# EAGLE schematic 2018-SPIT-IH-Ver4-Atmeha-final1 (EAGLE 6.1)

## Sheet 1 of 3
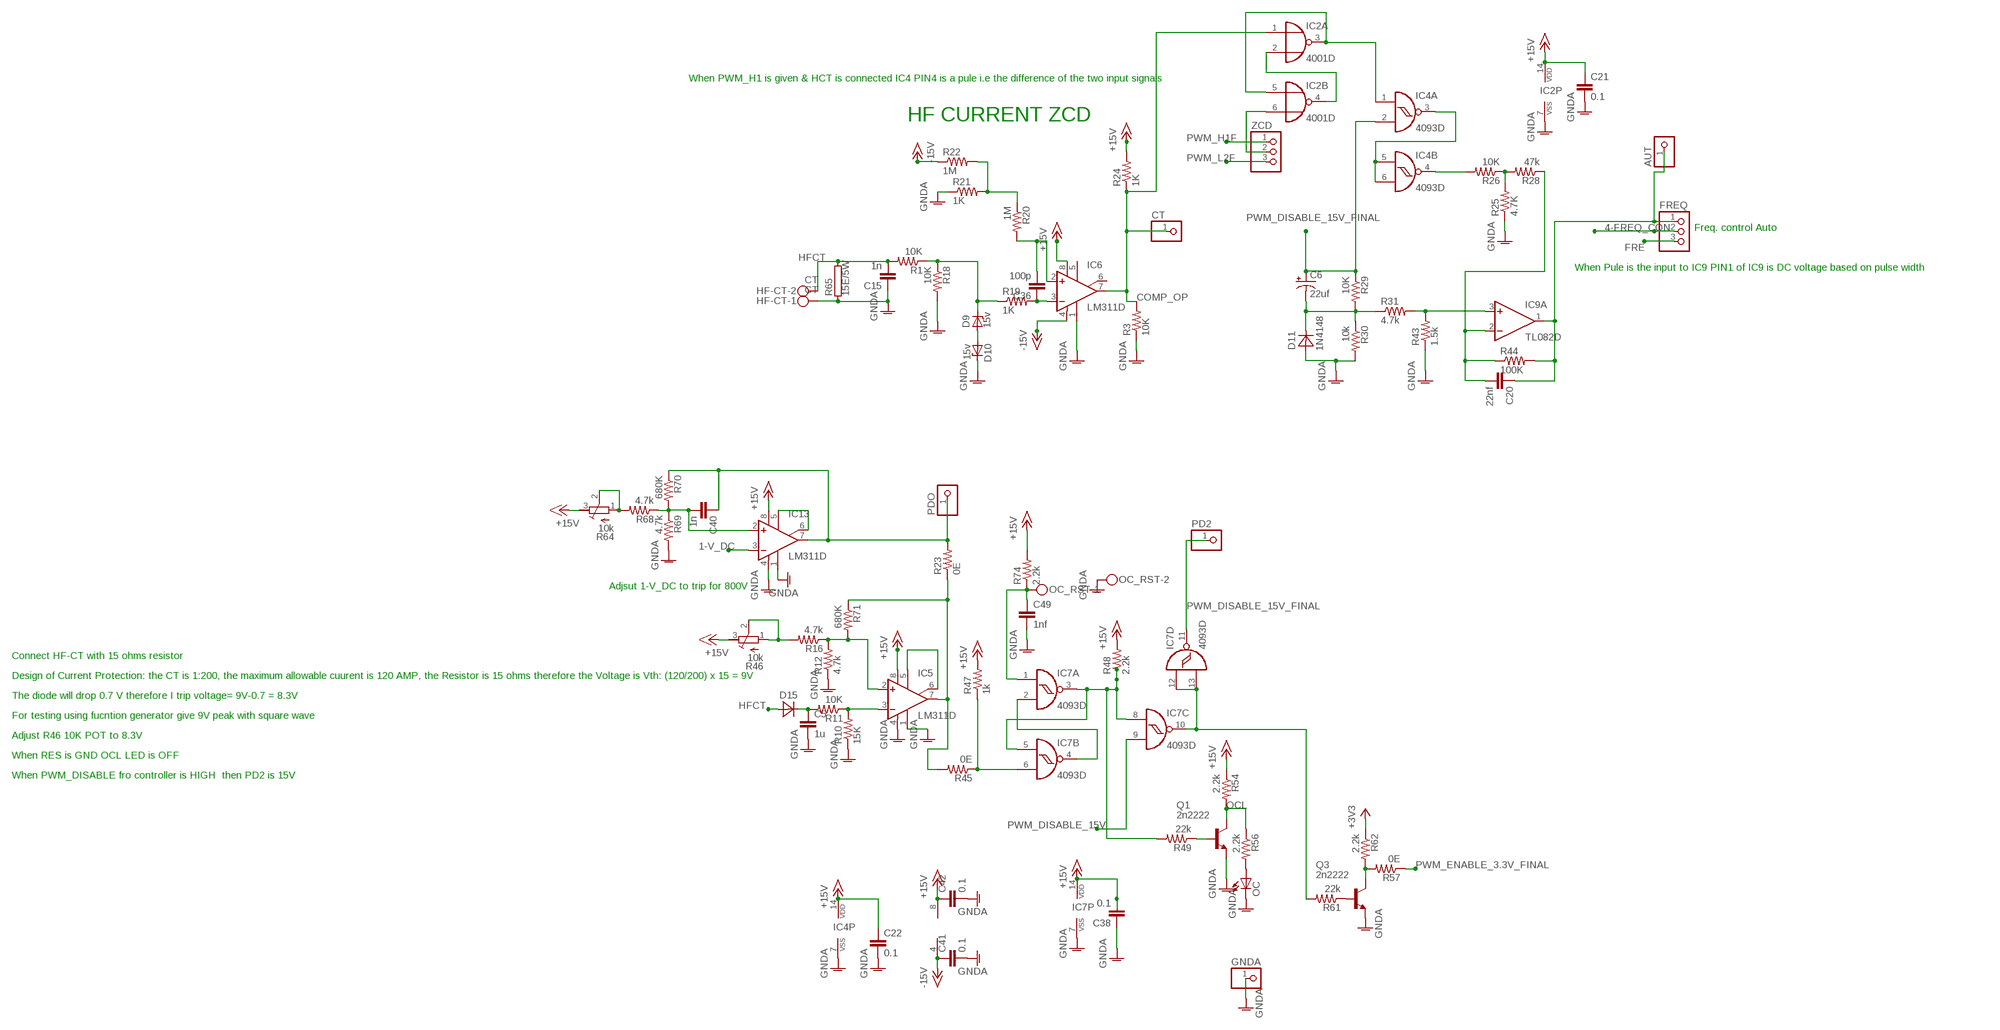
[diagram p0: schematic, sheet 1, part 1 of 2]
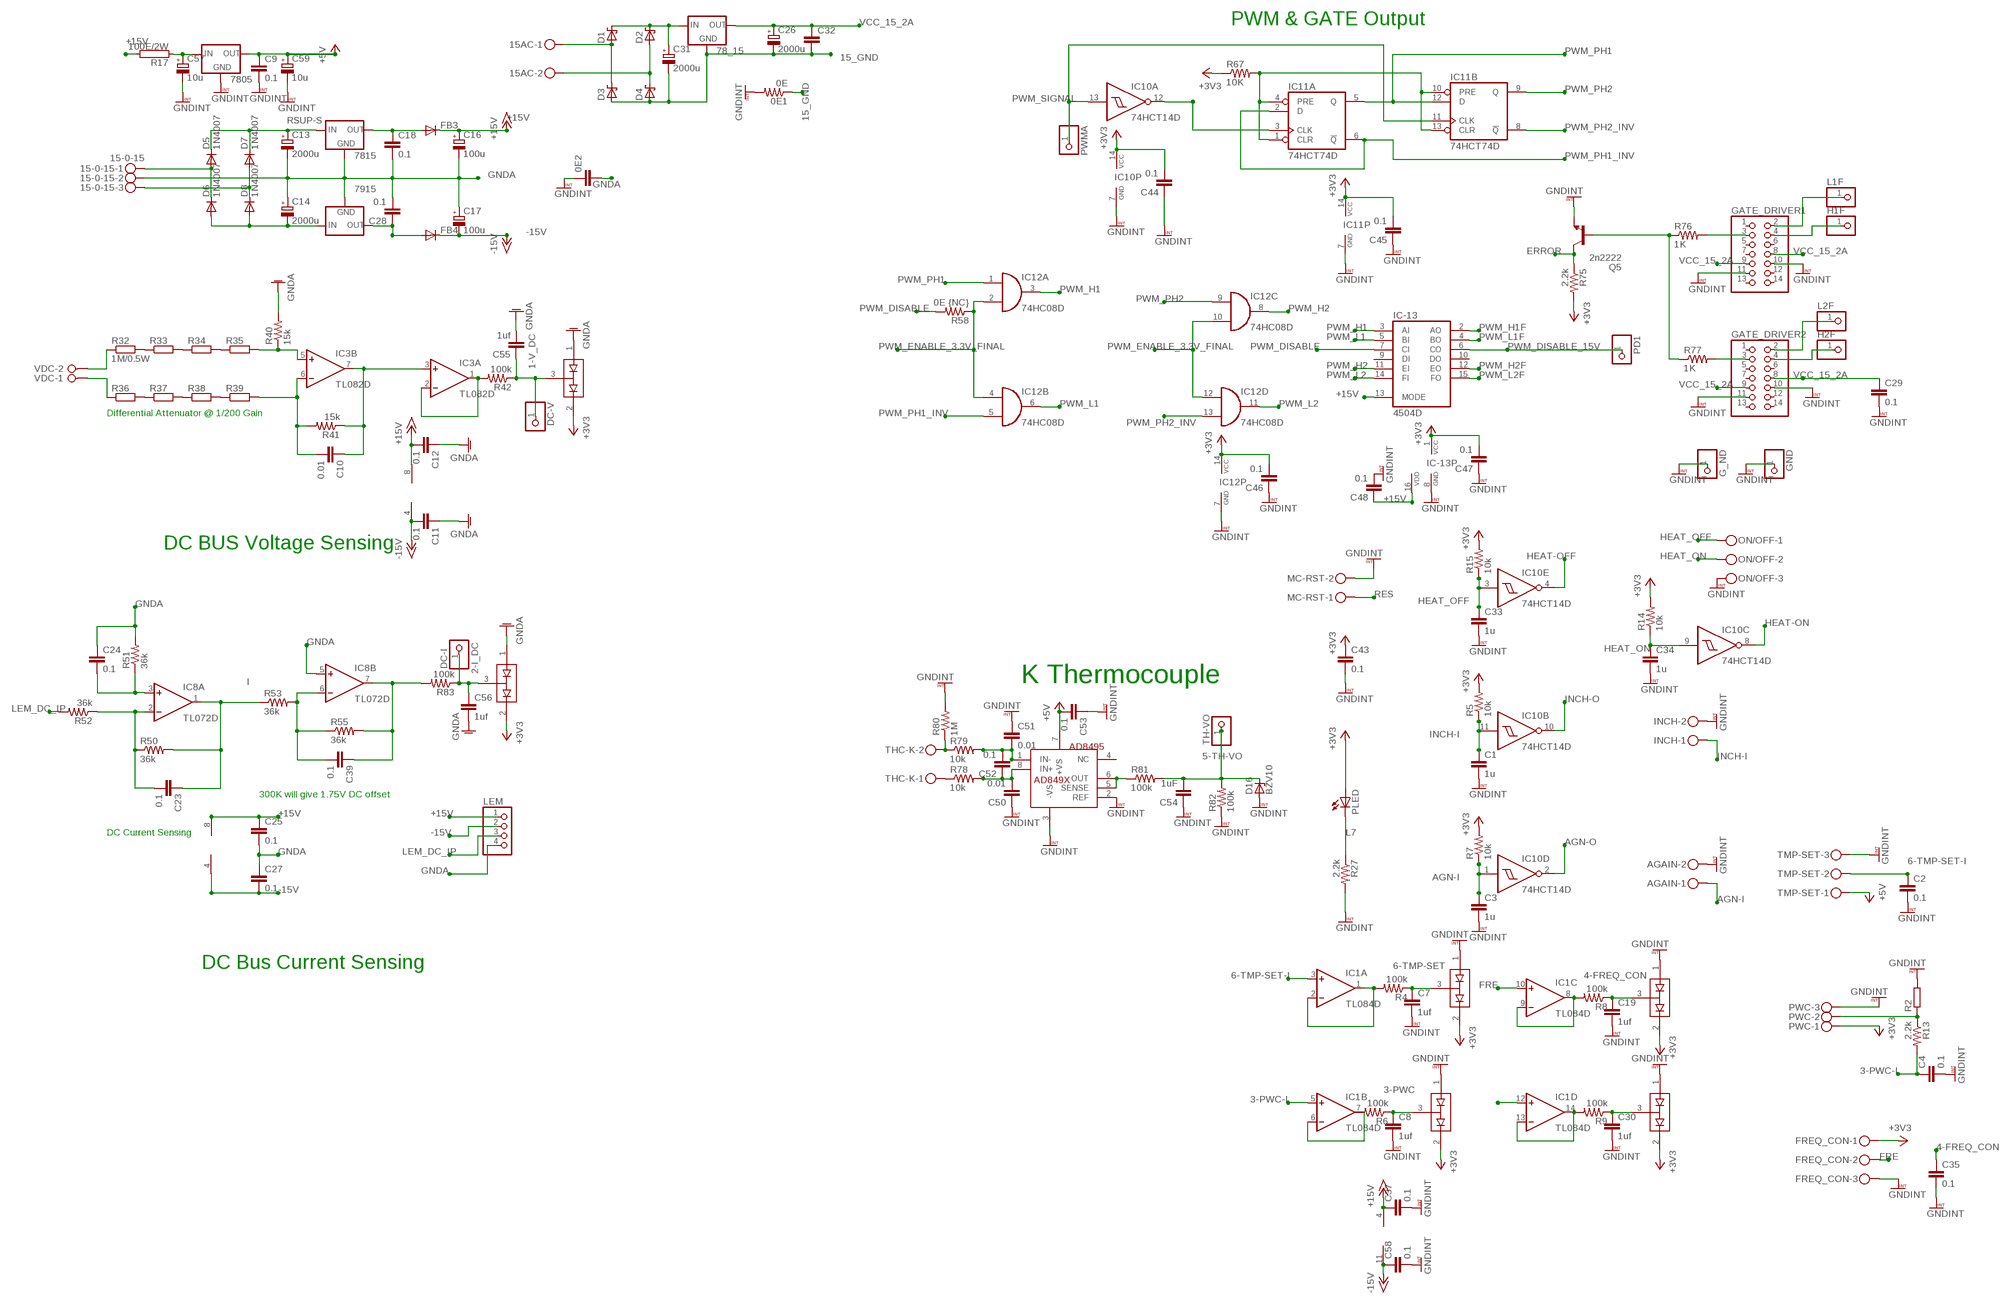
[diagram p1: schematic, sheet 1, part 2 of 2]

### Parts
0E1  0E  R-US_M1206  [M1206]
0E2  C-EUC1206  [C1206]
15-0-15  15-0-15  MKDSN1,5/3-5,08  [MKDSN1,5/3-5,08]
15AC  MKDSN1,5/2-5,08  [MKDSN1,5/2-5,08]
78_15  78XX-TO3  [TO3-78]
7805  78XXS  [78XXS]
7815  78XXS  [78XXS]
7915  79XXS  [79XXS]
AD8495  AD849X  [MSOP8]
AGAIN  MKDSN1,5/2-5,08  [MKDSN1,5/2-5,08]
AUT  PINHD-1X1  [1X01]
C1  1u  C-EUC1206  [C1206]
C2  0.1  C-EUC1206  [C1206]
C3  1u  C-EUC1206  [C1206]
C4  0.1  C-EUC1206  [C1206]
C5  1u  C-EUC1206  [C1206]
C6  22uf  CPOL-USE2.5-6  [E2,5-6]
C7  1uf  C-EUC1206  [C1206]
C8  1uf  C-EUC1206  [C1206]
C9  0.1  C-EUC1206  [C1206]
C10  0.01  C-EUC1206  [C1206]
C11  0.1  C-EUC1206  [C1206]
C12  0.1  C-EUC1206  [C1206]
C13  2000u  CPOL-EUE5-13  [E5-13]
C14  2000u  CPOL-EUE5-13  [E5-13]
C15  1n  C-EUC1206  [C1206]
C16  100u  CPOL-EUE5-8.5  [E5-8,5]
C17  100u  CPOL-EUE5-8.5  [E5-8,5]
C18  0.1  C-EUC1206  [C1206]
C19  1uf  C-EUC1206  [C1206]
C20  22nf  C-EUC1206  [C1206]
C21  0.1  C-EUC1206  [C1206]
C22  0.1  C-EUC1206  [C1206]
C23  0.1  C-EUC1206  [C1206]
C24  0.1  C-EUC1206  [C1206]
C25  0.1  C-EUC1206  [C1206]
C26  2000u  CPOL-EUE7.5-18  [E7,5-18]
C27  0.1  C-EUC1206  [C1206]
C28  0.1  C-EUC1206  [C1206]
C29  0.1  C-EUC1206  [C1206]
C30  1uf  C-EUC1206  [C1206]
C31  2000u  CPOL-EUE7.5-18  [E7,5-18]
C32  C-EU025-025X050  [C025-025X050]
C33  1u  C-EUC1206  [C1206]
C34  1u  C-EUC1206  [C1206]
C35  0.1  C-EUC1206  [C1206]
C36  100p  C-EUC1206  [C1206]
C37  0.1  C-EUC1206  [C1206]
C38  0.1  C-EUC1206  [C1206]
C39  0.1  C-EUC1206  [C1206]
C40  1n  C-EUC1206  [C1206]
C41  0.1  C-EUC1206  [C1206]
C42  0.1  C-EUC1206  [C1206]
C43  0.1  C-EUC1206  [C1206]
C44  0.1  C-EUC1206  [C1206]
C45  0.1  C-EUC1206  [C1206]
C46  0.1  C-EUC1206  [C1206]
C47  0.1  C-EUC1206  [C1206]
C48  0.1  C-EUC1206  [C1206]
C49  1nf  C-EUC1206  [C1206]
C50  0.01  C-EUC1206  [C1206]
C51  0.01  C-EUC1206  [C1206]
C52  0.1  C-EUC1206  [C1206]
C53  0.1  C-EUC1206  [C1206]
C54  1uF  C-EUC1206  [C1206]
C55  1uf  C-EUC1206  [C1206]
C56  1uf  C-EUC1206  [C1206]
C57  10u  CPOL-EUR/2012-12R  [R/2012-12R]
C58  0.1  C-EUC1206  [C1206]
C59  10u  CPOL-EUR/2012-12R  [R/2012-12R]
CT  PINHD-1X1  [1X01]
D1  1N5908  [C4111-15]
D2  1N5908  [C4111-15]
D3  1N5908  [C4111-15]
D4  1N5908  [C4111-15]
D5  1N4007  1N4004  [DO41-10]
D6  1N4007  1N4004  [DO41-10]
D7  1N4007  1N4004  [DO41-10]
D8  1N4007  1N4004  [DO41-10]
D9  15v  ZENER-DIODEDO34-7  [DO34Z7]
D10  15v  ZENER-DIODEDO34-7  [DO34Z7]
D11  1N4148  MBRA340T3  [SMA]
D12  BAV99  [SOT23]
D14  BAV99  [SOT23]
D15  MBRA340T3  [SMA]
D16  BZV10  [DO34Z7]
D17  BAV99  [SOT23]
D18  BAV99  [SOT23]
D19  BAV99  [SOT23]
D20  BAV99  [SOT23]
DC-I  PINHD-1X1  [1X01]
DC-V  PINHD-1X1  [1X01]
FB3  1N5061  [SOD57-10]
FB4  1N5061  [SOD57-10]
FREQ  PINHD-1X3  [1X03]
FREQ_CON  MKDSN1,5/3-5,08  [MKDSN1,5/3-5,08]
G_ND  PINHD-1X1  [1X01]
GATE_DRIVER1  PINHD-2X7  [2X07]
GATE_DRIVER2  PINHD-2X7  [2X07]
GND  PINHD-1X1  [1X01]
GNDA  PINHD-1X1  [1X01]
H1F  PINHD-1X1  [1X01]
H2F  PINHD-1X1  [1X01]
HF-CT  CT  MKDSN1,5/2-5,08  [MKDSN1,5/2-5,08]
IC1  TL084D  [SO14]
IC2  4001D  [SO14]
IC3  TL082D  [SO08]
IC4  4093D  [SO14]
IC5  LM311D  [SO08]
IC6  LM311D  [SO08]
IC7  4093D  [SO14]
IC8  TL072D  [SO08]
IC9  TL082D  [SO08]
IC10  74HCT14D  [SO14]
IC11  74HCT74D  [SO14]
IC12  74HC08D  [SO14]
IC13  LM311D  [SO08]
IC-13  4504D  [SO16]
INCH  MKDSN1,5/2-5,08  [MKDSN1,5/2-5,08]
L1F  PINHD-1X1  [1X01]
L2F  PINHD-1X1  [1X01]
LEM  PINHD-1X4  [1X04]
MC-RST  MKDSN1,5/2-5,08  [MKDSN1,5/2-5,08]
OC  LEDCHIPLED_1206  [CHIPLED_1206]
OC_RST  MKDSN1,5/2-5,08  [MKDSN1,5/2-5,08]
ON/OFF  MKDSN1,5/3-5,08  [MKDSN1,5/3-5,08]
PD1  PINHD-1X1  [1X01]
PD2  PINHD-1X1  [1X01]
PDO  PINHD-1X1  [1X01]
PLED  LEDCHIPLED_1206  [CHIPLED_1206]
PWC  MKDSN1,5/3-5,08  [MKDSN1,5/3-5,08]
PWMA  PINHD-1X1  [1X01]
Q1  2n2222  BCW33SMD  [SOT23-BEC]
Q3  2n2222  BCW33SMD  [SOT23-BEC]
Q5  2n2222  BCW33SMD  [SOT23-BEC]
R1  10K  R-US_M1206  [M1206]
R2  R-EU_0309/12  [0309/12]
R3  10K  R-US_M1206  [M1206]
R4  100k  R-US_M1206  [M1206]
R5  10k  R-US_M1206  [M1206]
R6  100k  R-US_M1206  [M1206]
R7  10k  R-US_M1206  [M1206]
R8  100k  R-US_M1206  [M1206]
R9  100k  R-US_M1206  [M1206]
R10  15K  R-US_M1206  [M1206]
R11  10K  R-US_M1206  [M1206]
R12  4.7k  R-US_M1206  [M1206]
R13  2.2k  R-US_M1206  [M1206]
R14  10k  R-US_M1206  [M1206]
R15  10k  R-US_M1206  [M1206]
R16  4.7k  R-US_M1206  [M1206]
R17  100E/2W  RCA5050  [CA5050]
R18  10K  R-US_M1206  [M1206]
R19  1K  R-US_M1206  [M1206]
R20  1M  R-US_M1206  [M1206]
R21  1K  R-US_M1206  [M1206]
R22  1M  R-US_M1206  [M1206]
R23  0E  R-US_M1206  [M1206]
R24  1K  R-US_M1206  [M1206]
R25  4.7K  R-US_M1206  [M1206]
R26  10K  R-US_M1206  [M1206]
R27  2.2k  R-US_M1206  [M1206]
R28  47k  R-US_M1206  [M1206]
R29  10K  R-US_M1206  [M1206]
R30  10k  R-US_M1206  [M1206]
R31  4.7k  R-US_M1206  [M1206]
R32  1M/0.5W  R-EU_0309/12  [0309/12]
R33  R-EU_0309/12  [0309/12]
R34  R-EU_0309/12  [0309/12]
R35  R-EU_0309/12  [0309/12]
R36  R-EU_0309/12  [0309/12]
R37  R-EU_0309/12  [0309/12]
R38  R-EU_0309/12  [0309/12]
R39  R-EU_0309/12  [0309/12]
R40  15k  R-US_M1206  [M1206]
R41  15k  R-US_M1206  [M1206]
R42  100k  R-US_M1206  [M1206]
R43  1.5k  R-US_M1206  [M1206]
R44  100K  R-US_M1206  [M1206]
R45  0E  R-US_M1206  [M1206]
R46  10k  R-TRIMM64W  [RTRIM64W]
R47  1k  R-US_M1206  [M1206]
R48  2.2k  R-US_M1206  [M1206]
R49  22k  R-US_M1206  [M1206]
R50  36k  R-US_M1206  [M1206]
R51  36k  R-US_M1206  [M1206]
R52  36k  R-US_M1206  [M1206]
R53  36k  R-US_M1206  [M1206]
R54  2.2k  R-US_M1206  [M1206]
R55  36k  R-US_M1206  [M1206]
R56  2.2k  R-US_M1206  [M1206]
R57  0E  R-US_M1206  [M1206]
R58  0E {NC}  R-US_M1206  [M1206]
R61  22k  R-US_M1206  [M1206]
R62  2.2k  R-US_M1206  [M1206]
R64  10k  R-TRIMM64W  [RTRIM64W]
R65  15E/5W  RMPC71-5  [MPC71-5]
R67  10K  R-US_M1206  [M1206]
R68  4.7k  R-US_M1206  [M1206]
R69  4.7k  R-US_M1206  [M1206]
R70  680K  R-US_M1206  [M1206]
R71  680K  R-US_M1206  [M1206]
R74  2.2k  R-US_M1206  [M1206]
R75  2.2k  R-US_M1206  [M1206]
R76  1K  R-US_M1206  [M1206]
R77  1K  R-US_M1206  [M1206]
R78  10k  R-US_M1206  [M1206]
R79  10k  R-US_M1206  [M1206]
R80  1M  R-US_M1206  [M1206]
R81  100k  R-US_M1206  [M1206]
R82  100k  R-US_M1206  [M1206]
R83  100k  R-US_M1206  [M1206]
TH-VO  PINHD-1X1  [1X01]
THC-K  MKDSN1,5/2-5,08  [MKDSN1,5/2-5,08]
TMP-SET  MKDSN1,5/3-5,08  [MKDSN1,5/3-5,08]
VDC  W237-2N  [W237-2N]
ZCD  PINHD-1X3  [1X03]

### Nets
1-V_DC: C55.1 D12.3(COM) DC-V.1 IC13.3(-IN) R42.1 ; also sheet 2
2: C39.1 IC8.7(B:OUT) R55.2 R83.2
2-I_DC: C56.1 D14.3(COM) DC-I.1 R83.1 ; also sheet 2
3-PWC: C8.1 D18.3(COM) R6.1 ; also sheet 2
3-PWC-I: C4.1 IC1.5(B:+IN) R13.2
4-FREQ_CON: C19.1 C35.1 D20.3(COM) FREQ.2 R8.1 ; also sheet 2
5-TH-VO: C54.2 D16.C R81.2 R82.2 TH-VO.1 ; also sheet 2
6-TMP-SET: C7.1 D17.3(COM) R4.1 ; also sheet 2
6-TMP-SET-I: C2.1 IC1.3(A:+IN) TMP-SET.2
15_GND: 0E1.1 78_15.3(GND) C26.- C31.- C32.2 D3.A D4.A
+5V: 7805.OUT AD8495.7(+VS) C9.1 C43.1 C44.2 C45.2 C46.2 C47.2 C53.2 C59.+ D12.2(C2) D14.2(C2) D17.2(C2) D18.2(C2) D19.2(C2) D20.2(C2) FREQ_CON.1 IC10.14(P:VCC) IC11.14(P:VCC) IC12.14(P:VCC) IC-13.1(VCC) PLED.A PWC.1 R5.2 R7.2 R14.2 R15.2 R62.1 R67.1 R75.2 TMP-SET.1 ; supply symbol labelled +3V3 ; also sheet 2
+15V: C12.2 C16.+ C21.1 C22.1 C25.1 C37.1 C38.2 C42.1 C48.1 FB3.C IC1.4(P:V+) IC2.14(P:VDD) IC3.8(P:V+) IC4.14(P:VDD) IC5.8(V+) IC6.8(V+) IC7.14(P:VDD) IC8.8(P:V+) IC9.8(P:V+) IC13.8(V+) IC-13.13(MODE) IC-13.16(VDD) LEM.1 R17.2 R24.2 R46.3(A) R47.2 R48.2 R54.1 R64.3(A) R74.2
-15V: C11.2 C17.- C27.2 C41.1 C58.1 FB4.C IC1.11(P:V-) IC3.4(P:V-) IC6.4(V-) IC8.4(P:V-) IC9.4(P:V-) LEM.2 R22.1
AGN-I: AGAIN.1 C3.1 IC10.1(D:I) R7.1
AGN-O: IC10.2(D:O) ; also sheet 2
COMP_OP: CT.1 IC2.1(A:I0) IC6.7(OUT) R3.2 R24.1
ERROR: Q5.C R75.1 ; also sheet 2
FRE: FREQ.3 FREQ_CON.2 IC1.10(C:+IN)
GNDA: 0E2.2 15-0-15.2 7815.GND 7915.GND C5.2 C11.1 C12.1 C13.- C14.+ C15.1 C16.- C17.+ C18.2 C21.2 C22.2 C24.1 C25.2 C27.1 C28.2 C38.1 C41.2 C42.2 C49.2 C55.2 C56.2 D10.C D11.A D12.1(A1) D14.1(A1) GNDA.1 HF-CT.1 IC2.7(P:VSS) IC4.7(P:VSS) IC5.1(GND) IC5.4(V-) IC6.1(GND) IC7.7(P:VSS) IC8.5(B:+IN) IC13.1(GND) IC13.4(V-) LEM.4 OC.C OC_RST.2 Q1.E Q3.E R3.1 R10.1 R12.1 R18.2 R21.1 R25.1 R30.2 R40.2 R43.1 R51.2 R65.1 R69.2
GNDINT: 0E1.2 0E2.1 7805.GND AD8495.2(REF) AD8495.3(-VS) AGAIN.2 C1.2 C2.2 C3.2 C4.2 C7.2 C8.2 C9.2 C19.2 C29.2 C30.2 C33.2 C34.2 C35.2 C37.2 C43.2 C44.1 C45.1 C46.1 C47.1 C48.2 C50.1 C51.1 C53.1 C54.1 C57.- C58.2 C59.- D16.A D17.1(A1) D18.1(A1) D19.1(A1) D20.1(A1) FREQ_CON.3 G_ND.1 GATE_DRIVER1.10 GATE_DRIVER1.11 GATE_DRIVER2.10 GATE_DRIVER2.11 GND.1 IC10.7(P:GND) IC11.7(P:GND) IC12.7(P:GND) IC-13.8(GND) INCH.2 MC-RST.2 ON/OFF.3 PWC.3 Q5.E R2.2 R27.2 R80.2 R82.1 TMP-SET.3 ; also sheet 2
HEAT-OFF: IC10.4(E:O) ; also sheet 2
HEAT-ON: IC10.8(C:O) ; also sheet 2
HEAT_OFF: C33.1 IC10.3(E:I) ON/OFF.1 R15.1
HEAT_ON: C34.1 IC10.9(C:I) ON/OFF.2 R14.1
HFCT: C15.2 D15.A HF-CT.2 R1.2 R65.2
I: C23.1 IC8.1(A:OUT) R50.2 R53.1
INCH-I: C1.1 IC10.11(B:I) INCH.1 R5.1
INCH-O: IC10.10(B:O) ; also sheet 2
L7: PLED.C R27.1
LEM_DC_IP: LEM.3 R52.2
N$1: IC1.1(A:OUT) IC1.2(A:-IN) R4.2
N$2: IC4.3(A:O) IC4.5(B:I0) IC4.6(B:I1)
N$3: IC1.6(B:-IN) IC1.7(B:OUT)
N$4: IC1.8(C:OUT) IC1.9(C:-IN) R8.2
N$5: C49.1 IC7.1(A:I0) OC_RST.1 R74.1
N$6: IC1.13(D:-IN) IC1.14(D:OUT) R9.2
N$7: IC2.2(A:I1) IC2.4(B:O)
N$8: IC4.4(B:O) R26.2
N$9: AUT.1 C20.1 FREQ.1 IC9.1(A:OUT) R44.2
N$10: 15-0-15.1 D5.A D6.C
N$12: AD8495.8(IN+) C50.2 C52.1 R78.2
N$13: IC5.2(+IN) R12.2 R16.1 R71.2
N$14: IC2.3(A:O) IC2.5(B:I0) IC4.1(A:I0)
N$15: IC10.12(A:O) IC11.3(A:CLK)
N$16: IC5.5(ON) IC5.6(ON/STR)
N$17: IC5.3(-IN) R10.2 R11.1
N$18: PWC.2 R2.1 R13.1
N$19: IC11.1(A:CLR) IC11.4(A:PRE) IC11.10(B:PRE) IC11.13(B:CLR) R67.2
N$20: GATE_DRIVER1.3 R76.2
N$21: IC5.7(OUT) R23.1 R45.2 R71.1
N$22: IC7.6(B:I1) R45.1 R47.1
N$23: C5.1 D15.C R11.2
N$24: R32.2 R33.1
N$25: R33.2 R34.1
N$26: R34.2 R35.1
N$27: R36.2 R37.1
N$28: 15-0-15.3 D7.A D8.C
N$29: 7915.IN C14.- D6.A D8.A
N$30: D9.C R1.1 R18.1 R19.1
N$31: 7805.IN C57.+ R17.1
N$32: 7815.OUT C18.1 FB3.A
N$33: R37.2 R38.1
N$34: 7915.OUT C28.1 FB4.A
N$35: D9.A D10.A
N$36: R38.2 R39.1
N$37: C36.1 IC6.3(-IN) R19.2
N$38: C36.2 IC6.2(+IN) R20.2
N$39: R20.1 R21.2 R22.2
N$40: R16.2 R46.1(E) R46.2(S)
N$41: R32.1 VDC.2
N$42: Q1.B R49.1
N$43: R36.1 VDC.1
N$44: IC3.5(B:+IN) R35.2 R40.1
N$45: IC7.3(A:O) IC7.5(B:I0) IC7.8(C:I0) R48.1 R49.2
N$46: IC7.2(A:I1) IC7.4(B:O)
N$47: C10.2 IC3.6(B:-IN) R39.2 R41.2
N$48: C10.1 IC3.3(A:+IN) IC3.7(B:OUT) R41.1
N$49: R25.2 R26.1 R28.2
N$50: IC3.1(A:OUT) IC3.2(A:-IN) R42.2
N$51: AD8495.1(IN-) C51.2 C52.2 R79.2
N$52: IC7.10(C:O) IC7.12(D:I0) IC7.13(D:I1) R61.2
N$53: C6.- D11.C R29.2 R30.1 R31.1
N$54: IC1.12(D:+IN)
N$55: OC.A R56.2
N$56: IC2.6(B:I1) ZCD.2
N$57: IC9.3(A:+IN) R31.2 R43.2
N$58: GATE_DRIVER2.3 R77.2
N$59: C20.2 IC9.2(A:-IN) R28.1 R44.1
N$60: Q3.B R61.1
N$61: C23.2 IC8.2(A:-IN) R50.1 R52.1
N$62: C24.2 IC8.3(A:+IN) R51.1
N$63: R78.1 THC-K.1
N$64: C39.2 IC8.6(B:-IN) R53.2 R55.1
N$65: Q3.C R57.2 R62.2
N$69: IC13.5(ON) IC13.6(ON/STR)
N$71: Q5.B R76.1 R77.1
N$72: R79.1 R80.1 THC-K.2
N$73: R64.1(E) R64.2(S) R68.2
N$74: C40.2 IC13.2(+IN) R68.1 R69.1 R70.2
N$75: C40.1 IC13.7(OUT) PDO.1 R23.2 R70.1
N$76: AD8495.5(SENSE) AD8495.6(OUT) R81.1
N$80: C30.1 D19.3(COM) R9.1
N$85: 15AC.1 D1.A D3.C
N$86: 15AC.2 D2.A D4.C
N$87: 78_15.2(IN) C31.+ D1.C D2.C
OCL: Q1.C R54.2 R56.1
PWM_DISABLE: IC-13.7(CI) R58.2 ; also sheet 2
PWM_DISABLE_15V: IC7.9(C:I1) IC-13.6(CO) PD1.1
PWM_DISABLE_15V_FINAL: C6.+ IC4.2(A:I1) IC7.11(D:O) PD2.1 R29.1
PWM_ENABLE_3.3V_FINAL: IC12.2(A:I1) IC12.4(B:I0) IC12.10(C:I1) IC12.12(D:I0) R57.1 R58.1 ; also sheet 2
PWM_H1: IC12.3(A:O) IC-13.3(AI)
PWM_H1F: GATE_DRIVER1.4 H1F.1 IC-13.2(AO) ZCD.1
PWM_H2: IC12.8(C:O) IC-13.11(EI)
PWM_H2F: GATE_DRIVER2.4 H2F.1 IC-13.12(EO)
PWM_L1: IC12.6(B:O) IC-13.5(BI)
PWM_L1F: GATE_DRIVER1.2 IC-13.4(BO) L1F.1
PWM_L2: IC12.11(D:O) IC-13.14(FI)
PWM_L2F: GATE_DRIVER2.2 IC-13.15(FO) L2F.1 ZCD.3
PWM_PH1: IC11.5(A:Q) IC11.12(B:D) IC12.1(A:I0)
PWM_PH1_INV: IC11.2(A:D) IC11.6(A:!Q) IC12.5(B:I1)
PWM_PH2: IC11.9(B:Q) IC12.9(C:I0)
PWM_PH2_INV: IC11.8(B:!Q) IC12.13(D:I1)
PWM_SIGNAL: IC10.13(A:I) IC11.11(B:CLK) PWMA.1 ; also sheet 2
RES: MC-RST.1 ; also sheet 2
RSUP-S: 7815.IN C13.+ D5.C D7.C
VCC_15_2A: 78_15.1(OUT) C26.+ C29.1 C32.1 GATE_DRIVER1.8 GATE_DRIVER1.9 GATE_DRIVER2.8 GATE_DRIVER2.9
Unconnected: AD8495.4(NC) GATE_DRIVER1.1 GATE_DRIVER1.5 GATE_DRIVER1.6 GATE_DRIVER1.7 GATE_DRIVER1.12 GATE_DRIVER1.13 GATE_DRIVER1.14 GATE_DRIVER2.1 GATE_DRIVER2.5 GATE_DRIVER2.6 GATE_DRIVER2.7 GATE_DRIVER2.12 GATE_DRIVER2.13 GATE_DRIVER2.14 IC2.8(C:I0) IC2.9(C:I1) IC2.10(C:O) IC2.11(D:O) IC2.12(D:I0) IC2.13(D:I1) IC4.8(C:I0) IC4.9(C:I1) IC4.10(C:O) IC4.11(D:O) IC4.12(D:I0) IC4.13(D:I1) IC6.5(ON) IC6.6(ON/STR) IC9.5(B:+IN) IC9.6(B:-IN) IC9.7(B:OUT) IC10.5(F:I) IC10.6(F:O) IC-13.9(DI) IC-13.10(DO) R6.2

### Notes on the sheet
- PWM & GATE Output
- Differential Attenuator @ 1/200 Gain
- DC BUS Voltage Sensing
- K Thermocouple
- 300K will give 1.75V DC offset
- DC Current Sensing
- DC Bus Current Sensing
- When PWM_H1 is given & HCT is connected IC4 PIN4 is a pule i.e the difference of the two input signals
- HF CURRENT ZCD
- Freq. control Auto
- When Pule is the input to IC9 PIN1 of IC9 is DC voltage based on pulse width
- Adjsut 1-V_DC to trip for 800V
- Connect HF-CT with 15 ohms resistor
- Design of Current Protection: the CT is 1:200, the maximum allowable cuurent is 120 AMP, the Resistor is 15 ohms therefore the Voltage is Vth: (120/200) x 15 = 9V
- The diode will drop 0.7 V therefore I trip voltage= 9V-0.7 = 8.3V
- For testing using fucntion generator give 9V peak with square wave
- Adjust R46 10K POT to 8.3V
- When RES is GND OCL LED is OFF
- When PWM_DISABLE fro controller is HIGH  then PD2 is 15V

## Sheet 2 of 3
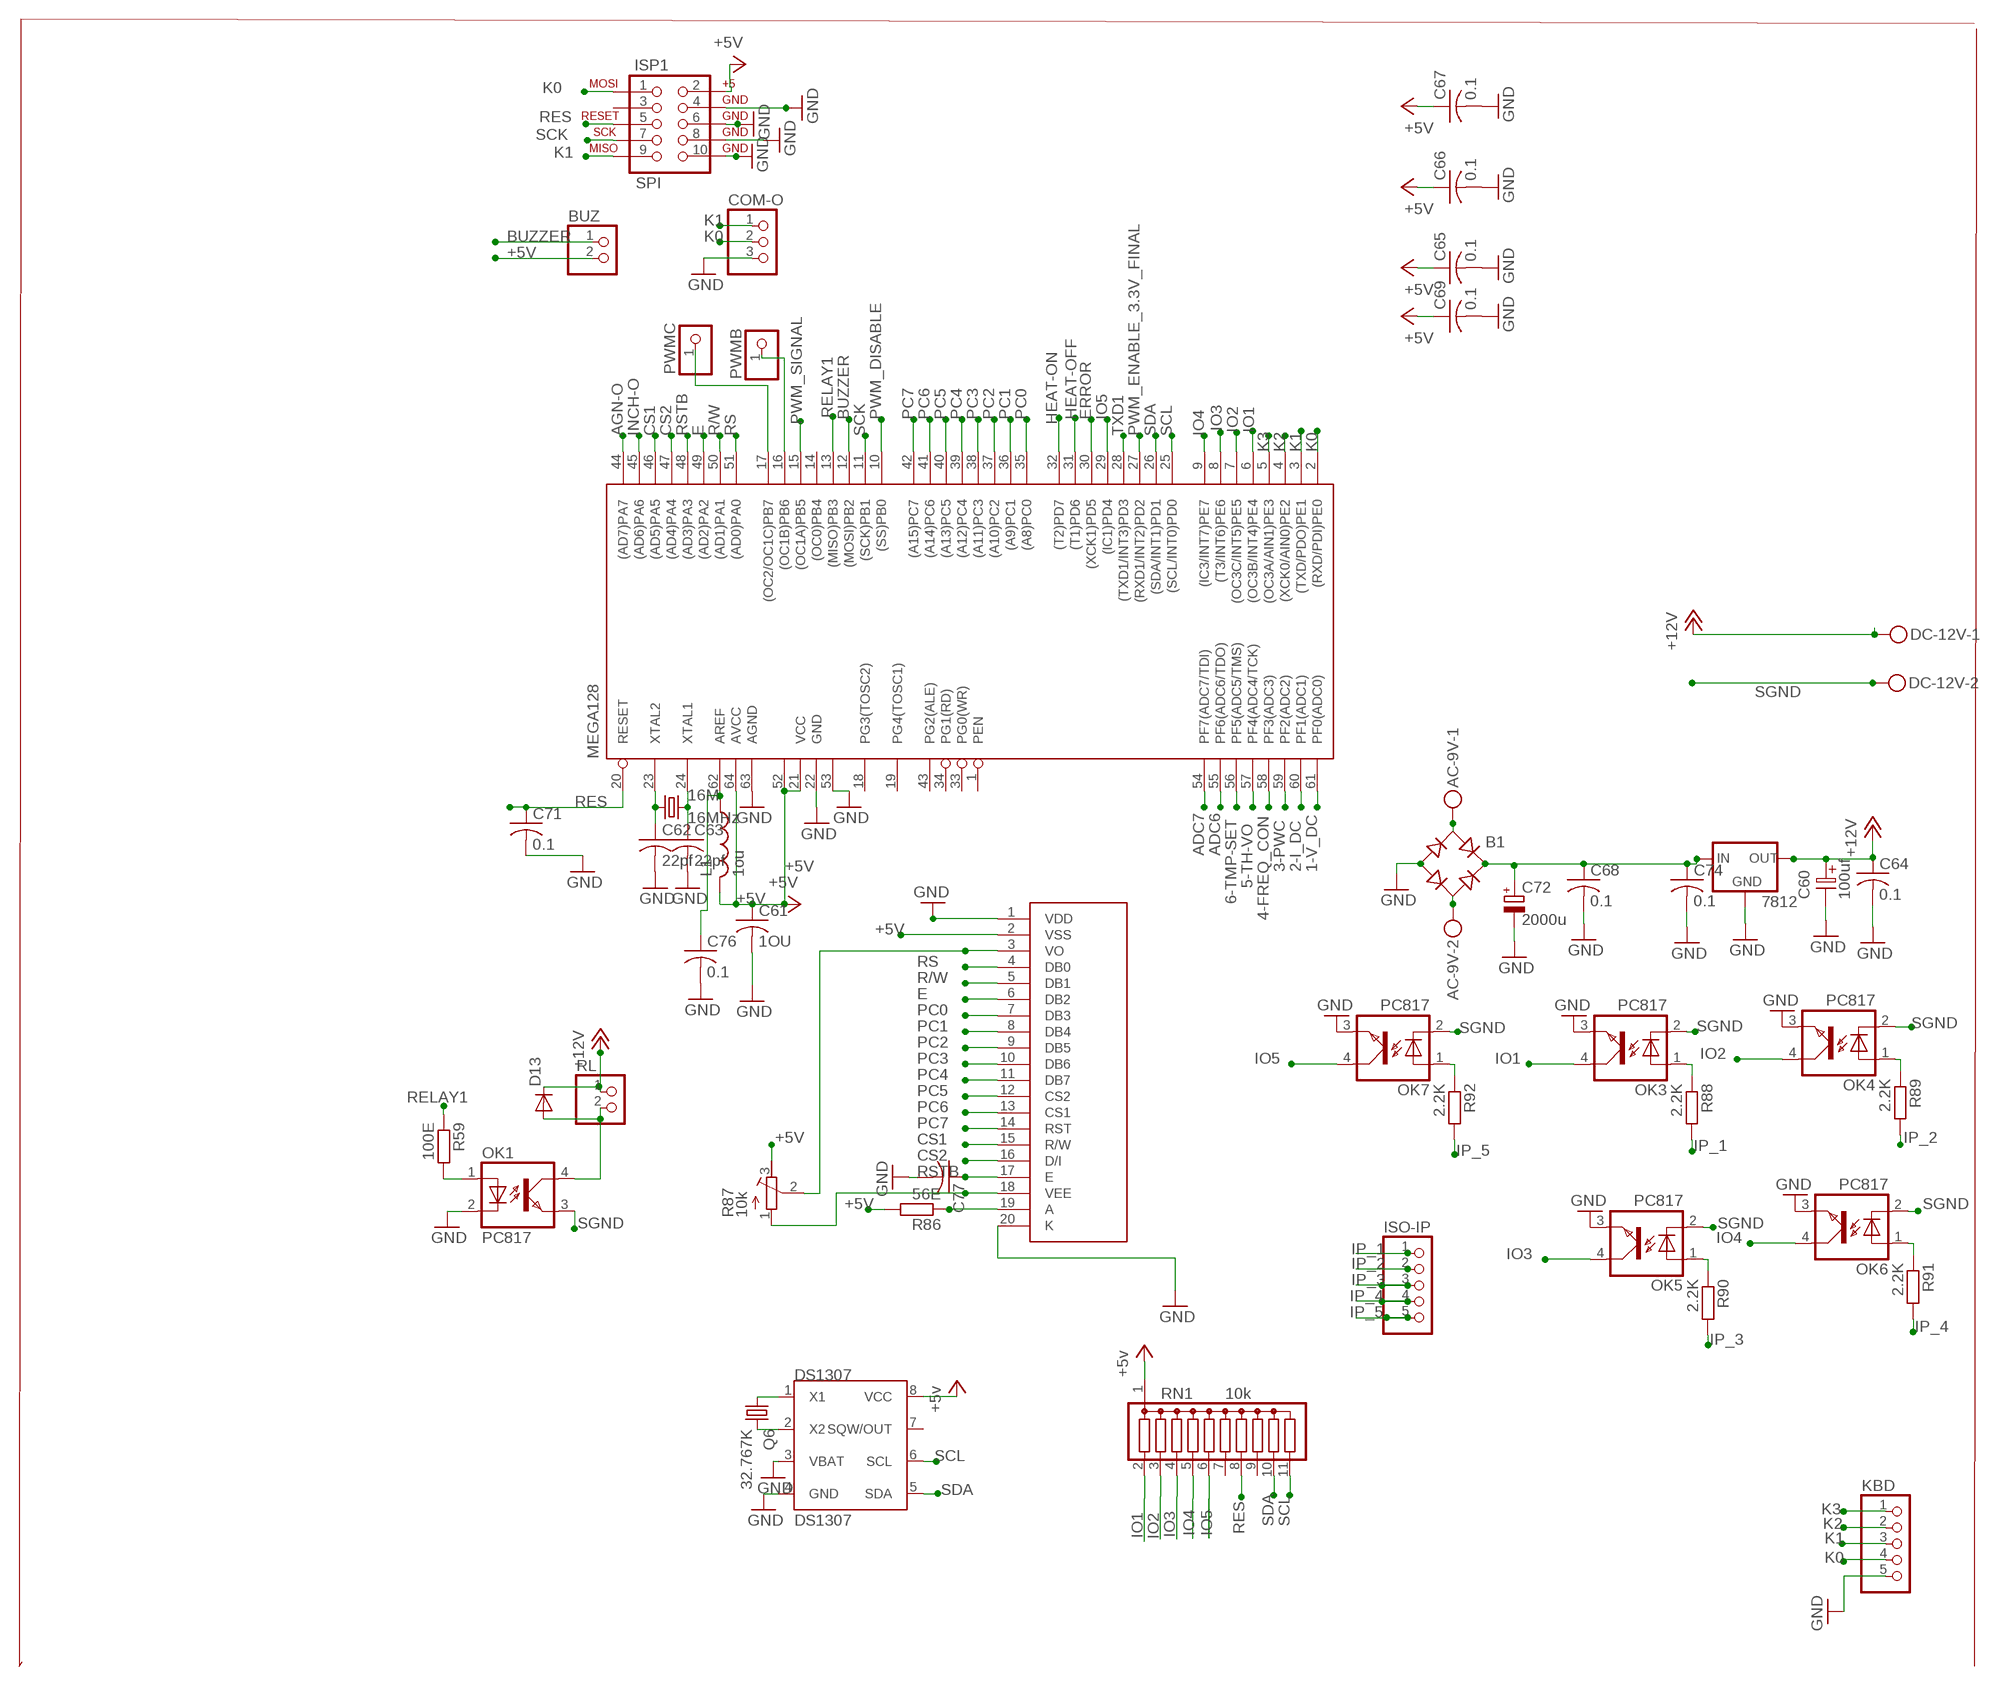
[diagram p2: schematic, sheet 2]

### Parts
16M  16MHz  CRYTALHC49S  [HC49/S]
7812  78XXS  [78XXS]
AC-9V  MKDSN1,5/2-5,08  [MKDSN1,5/2-5,08]
B1  RB1A  [RB1A]
BUZ  PINHD-1X2  [1X02]
C60  100uf  ELC-2,5  [ES-2,5]
C61  1OU  C-USC1206  [C1206]
C62  22pf  C-USC1206  [C1206]
C63  22pf  C-USC1206  [C1206]
C64  0.1  C-USC1206  [C1206]
C65  0.1  C-USC1206  [C1206]
C66  0.1  C-USC1206  [C1206]
C67  0.1  C-USC1206  [C1206]
C68  0.1  C-USC1206  [C1206]
C69  0.1  C-USC1206  [C1206]
C71  0.1  C-USC1206  [C1206]
C72  2000u  CPOL-EUE5-10.5  [E5-10,5]
C74  0.1  C-USC1206  [C1206]
C76  0.1  C-USC1206  [C1206]
C77  C-USC1206  [C1206]
COM-O  PINHD-1X3  [1X03]
D13  1N4004  [DO41-10]
DC-12V  MKDSN1,5/2-5,08  [MKDSN1,5/2-5,08]
DS1307  DS1307  [SOIC-8]
GLCD  LCD-G12864BARE  [1X20]
ISO-IP  PINHD-1X5  [1X05]
ISP1  SPI  AVR_SPI_PROG2LOCK  [2X5-SHROUDED_LOCK]
KBD  PINHD-1X5  [1X05]
L1  1ou  L-US0207/10  [0207/10]
MEGA128  MEGA128-A  [TQFP64]
OK1  PC817  [DIL04]
OK3  PC817  [DIL04]
OK4  PC817  [DIL04]
OK5  PC817  [DIL04]
OK6  PC817  [DIL04]
OK7  PC817  [DIL04]
PWMB  PINHD-1X1  [1X01]
PWMC  PINHD-1X1  [1X01]
Q6  32.767K  CRYSTALTC26H  [TC26H]
R59  100E  R-EU_M1206  [M1206]
R86  56E  R-EU_M1206  [M1206]
R87  10k  R-TRIMM64W  [RTRIM64W]
R88  2.2K  R-EU_M1206  [M1206]
R89  2.2K  R-EU_M1206  [M1206]
R90  2.2K  R-EU_M1206  [M1206]
R91  2.2K  R-EU_M1206  [M1206]
R92  2.2K  R-EU_M1206  [M1206]
RL  PINHD-1X2  [1X02]
RN1  10k  G10R  [SIL11]

### Nets
1-V_DC: MEGA128.61(PF0(ADC0)) ; also sheet 1
2-I_DC: MEGA128.60(PF1(ADC1)) ; also sheet 1
3-PWC: MEGA128.59(PF2(ADC2)) ; also sheet 1
4-FREQ_CON: MEGA128.58(PF3(ADC3)) ; also sheet 1
5-TH-VO: MEGA128.57(PF4(ADC4/TCK)) ; also sheet 1
6-TMP-SET: MEGA128.56(PF5(ADC5/TMS)) ; also sheet 1
+5V: BUZ.2 C61.1 C65.1 C66.1 C67.1 C69.1 DS1307.8(VCC) GLCD.2(VSS) ISP1.2 L1.2 MEGA128.21(VCC) MEGA128.52(VCC1) MEGA128.64(AVCC) R86.2 R87.3(A) RN1.1 ; supply symbol labelled +5v ; also sheet 1
+12V: 7812.OUT C60.1 C64.1 D13.C DC-12V.1 RL.1
ADC6: MEGA128.55(PF6(ADC6/TDO))
ADC7: MEGA128.54(PF7(ADC7/TDI))
AGN-O: MEGA128.44((AD7)PA7) ; also sheet 1
BUZZER: BUZ.1 MEGA128.12((MOSI)PB2)
CS1: GLCD.15(R/W) MEGA128.46((AD5)PA5)
CS2: GLCD.16(D/I) MEGA128.47((AD4)PA4)
E: GLCD.6(DB2) MEGA128.49((AD2)PA2)
ERROR: MEGA128.30((XCK1)PD5) ; also sheet 1
GNDINT: C61.2 C62.2 C63.2 C65.2 C66.2 C67.2 C69.2 C71.2 C76.2 C77.2 COM-O.3 DS1307.3(VBAT) DS1307.4(GND) GLCD.1(VDD) GLCD.20(K) ISP1.4 ISP1.6 ISP1.8 ISP1.10 KBD.5 MEGA128.22(GND) MEGA128.53(GND1) MEGA128.63(AGND) OK1.2(C) OK3.3(EMIT) OK4.3(EMIT) OK5.3(EMIT) OK6.3(EMIT) OK7.3(EMIT) ; supply symbol labelled GND ; also sheet 1
HEAT-OFF: MEGA128.31((T1)PD6) ; also sheet 1
HEAT-ON: MEGA128.32((T2)PD7) ; also sheet 1
INCH-O: MEGA128.45((AD6)PA6) ; also sheet 1
IO1: MEGA128.6((OC3B/INT4)PE4) OK3.4(COL) RN1.2
IO2: MEGA128.7((OC3C/INT5)PE5) OK4.4(COL) RN1.3
IO3: MEGA128.8((T3/INT6)PE6) OK5.4(COL) RN1.4
IO4: MEGA128.9((IC3/INT7)PE7) OK6.4(COL) RN1.5
IO5: MEGA128.29((IC1)PD4) OK7.4(COL) RN1.6
IP_1: ISO-IP.1 R88.2
IP_2: ISO-IP.2 R89.2
IP_3: ISO-IP.3 R90.2
IP_4: ISO-IP.4 R91.2
IP_5: ISO-IP.5 R92.2
K0: COM-O.2 ISP1.1 KBD.4 MEGA128.2((RXD/PDI)PE0)
K1: COM-O.1 ISP1.9 KBD.3 MEGA128.3((TXD/PDO)PE1)
K2: KBD.2 MEGA128.4((XCK0/AIN0)PE2)
K3: KBD.1 MEGA128.5((OC3A/AIN1)PE3)
N$11: OK1.1(A) R59.2
N$66: D13.A OK1.4(COL) RL.2
N$70: MEGA128.16((OC1B)PB6) PWMB.1
N$77: MEGA128.17((OC2/OC1C)PB7) PWMC.1
N$82: 16M.1 C62.1 MEGA128.23(XTAL2)
N$83: 16M.2 C63.1 MEGA128.24(XTAL1)
N$84: GLCD.3(VO) R87.2(S)
N$88: GLCD.18(VEE) R87.1(E)
N$89: GLCD.19(A) R86.1
N$90: OK3.1(A) R88.1
N$91: OK4.1(A) R89.1
N$92: OK5.1(A) R90.1
N$93: OK6.1(A) R91.1
N$94: OK7.1(A) R92.1
N$95: DS1307.2(X2) Q6.2
N$96: DS1307.1(X1) Q6.1
N$97: AC-9V.1 B1.AC1
N$98: AC-9V.2 B1.AC2
N$99: C76.1 L1.1 MEGA128.62(AREF)
N$100: 7812.IN B1.+ C68.1 C72.+ C74.1
PC0: GLCD.7(DB3) MEGA128.35((A8)PC0)
PC1: GLCD.8(DB4) MEGA128.36((A9)PC1)
PC2: GLCD.9(DB5) MEGA128.37((A10)PC2)
PC3: GLCD.10(DB6) MEGA128.38((A11)PC3)
PC4: GLCD.11(DB7) MEGA128.39((A12)PC4)
PC5: GLCD.12(CS2) MEGA128.40((A13)PC5)
PC6: GLCD.13(CS1) MEGA128.41((A14)PC6)
PC7: GLCD.14(RST) MEGA128.42((A15)PC7)
PWM_DISABLE: MEGA128.10((SS)PB0) ; also sheet 1
PWM_ENABLE_3.3V_FINAL: MEGA128.27((RXD1/INT2)PD2) ; also sheet 1
PWM_SIGNAL: MEGA128.15((OC1A)PB5) ; also sheet 1
R/W: GLCD.5(DB1) MEGA128.50((AD1)PA1)
RELAY1: MEGA128.13((MISO)PB3) R59.1
RES: C71.1 ISP1.5 MEGA128.20(RESET) RN1.8 ; also sheet 1
RS: GLCD.4(DB0) MEGA128.51((AD0)PA0)
RSTB: C77.1 GLCD.17(E) MEGA128.48((AD3)PA3)
SCK: ISP1.7 MEGA128.11((SCK)PB1)
SCL: DS1307.6(SCL) MEGA128.25((SCL/INT0)PD0) RN1.11
SDA: DS1307.5(SDA) MEGA128.26((SDA/INT1)PD1) RN1.10
SGND: 7812.GND B1.- C60.2 C64.2 C68.2 C72.- C74.2 DC-12V.2 OK1.3(EMIT) OK3.2(C) OK4.2(C) OK5.2(C) OK6.2(C) OK7.2(C) ; supply symbol labelled GND
TXD1: MEGA128.28((TXD1/INT3)PD3)
Unconnected: DS1307.7(SQW/OUT) ISP1.3 MEGA128.1(PEN) MEGA128.14((OC0)PB4) MEGA128.18(PG3(TOSC2)) MEGA128.19(PG4(TOSC1)) MEGA128.33(PG0(WR)) MEGA128.34(PG1(RD)) MEGA128.43(PG2(ALE)) RN1.7 RN1.9

## Sheet 3 of 3
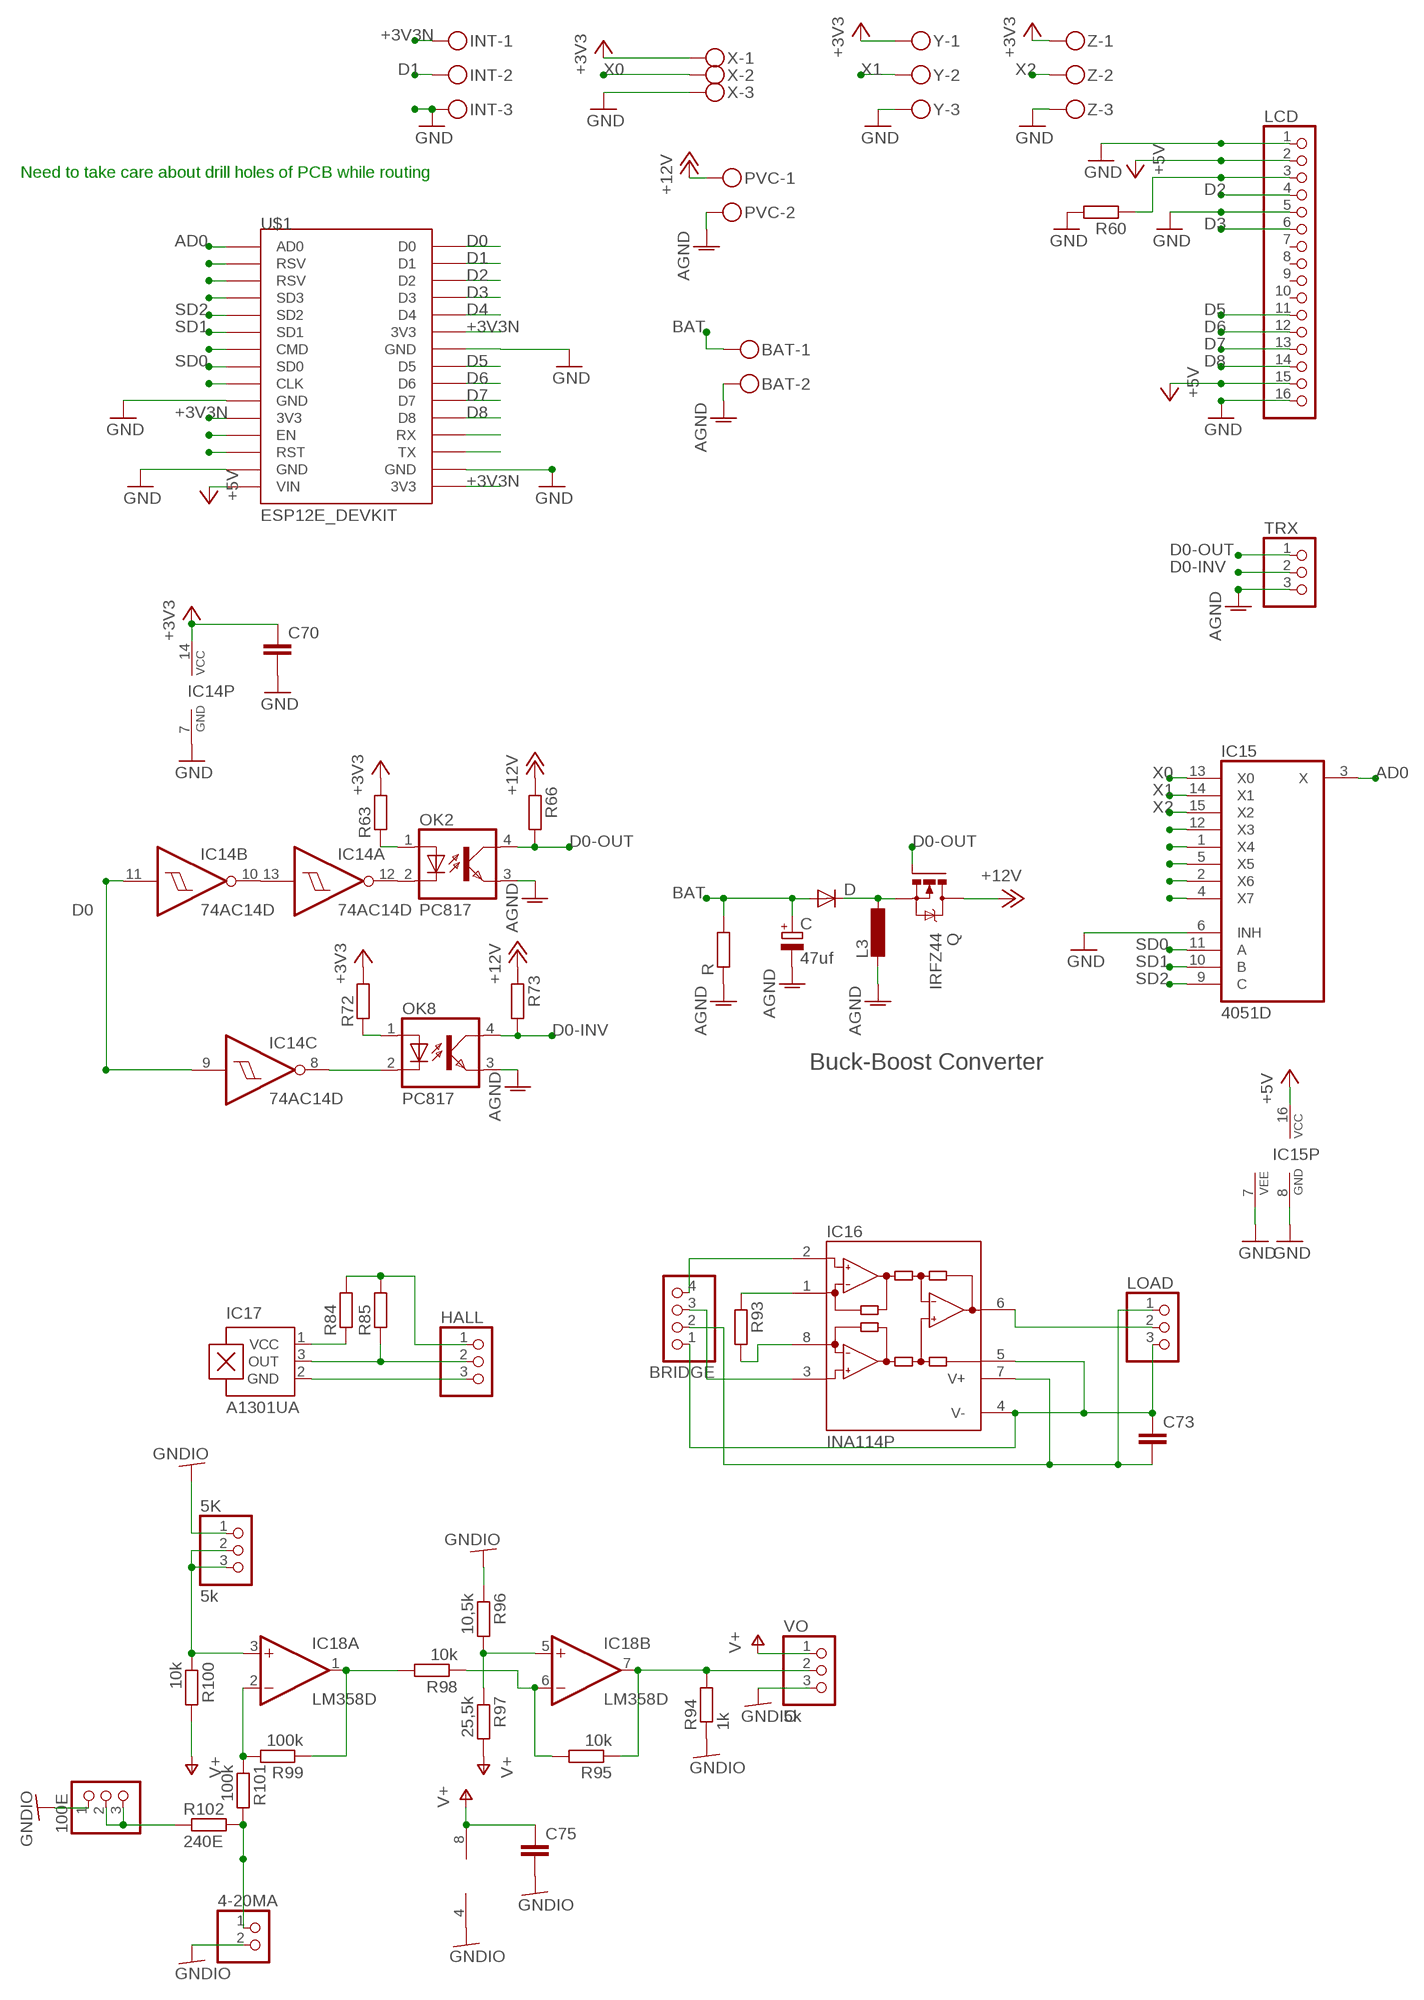
[diagram p3: schematic, sheet 3]

### Parts
4-20MA  PINHD-1X2  [1X02]
5K  5k  PINHD-1X3  [1X03]
100E  PINHD-1X3  [1X03]
BAT  MKDSN1,5/2-5,08  [MKDSN1,5/2-5,08]
BRIDGE  PINHD-1X4  [1X04]
C  47uf  CPOL-EUB45181A  [B45181A]
C70  C-EUC1206  [C1206]
C73  C-EUC1206  [C1206]
C75  C-EUC1206  [C1206]
D  1N4004  [DO41-10]
HALL  PINHD-1X3  [1X03]
IC14  74AC14D  [SO14]
IC15  4051D  [SO16]
IC16  INA114P  [DIL08]
IC17  A1301UA  [SIP3-UA]
IC18  LM358D  [SO08]
INT  MKDSN1,5/3-5,08  [MKDSN1,5/3-5,08]
L3  L-EU0207/12  [0207/12]
LCD  PINHD-1X16  [1X16]
LOAD  PINHD-1X3  [1X03]
OK2  PC817  [DIL04]
OK8  PC817  [DIL04]
PVC  MKDSN1,5/2-5,08  [MKDSN1,5/2-5,08]
Q  IRFZ44  IRF540  [TO220BV]
R  R-EU_0207/10  [0207/10]
R60  R-EU_M1206  [M1206]
R63  R-EU_M1206  [M1206]
R66  R-EU_M1206  [M1206]
R72  R-EU_M1206  [M1206]
R73  R-EU_M1206  [M1206]
R84  R-EU_M1206  [M1206]
R85  R-EU_M1206  [M1206]
R93  R-EU_M1206  [M1206]
R94  1k  R-EU_M1206  [M1206]
R95  10k  R-EU_M1206  [M1206]
R96  10,5k  R-EU_M1206  [M1206]
R97  25,5k  R-EU_M1206  [M1206]
R98  10k  R-EU_M1206  [M1206]
R99  100k  R-EU_M1206  [M1206]
R100  10k  R-EU_M1206  [M1206]
R101  100k  R-EU_M1206  [M1206]
R102  240E  R-EU_M1206  [M1206]
TRX  PINHD-1X3  [1X03]
U$1  ESP12E_DEVKIT  [ESP12E_DEVKIT]
VO  5k  PINHD-1X3  [1X03]
X  MKDSN1,5/3-5,08  [MKDSN1,5/3-5,08]
Y  MKDSN1,5/3-5,08  [MKDSN1,5/3-5,08]
Z  MKDSN1,5/3-5,08  [MKDSN1,5/3-5,08]

### Nets
+3V3N: C70.1 IC14.14(P:VCC) INT.1 R63.2 R72.2 U$1.3V3@0(3V3) U$1.3V3@1(3V3) U$1.3V3@2(3V3) X.1 Y.1 Z.1 ; supply symbol labelled +3V3
+5VN: IC15.16(VCC) LCD.2 LCD.15 U$1.VIN ; supply symbol labelled +5V
+12VN: PVC.1 Q.D R66.1 R73.1 ; supply symbol labelled +12V
AD0: IC15.3(X) U$1.AD0
BAT: BAT.1 C.+ D.A R.2
D0: IC14.9(C:I) IC14.11(B:I) U$1.D0
D0-INV: OK8.4(COL) R73.2 TRX.2
D0-OUT: OK2.4(COL) Q.G R66.2 TRX.1
D1: INT.2 U$1.D1
D2: LCD.4 U$1.D2
D3: LCD.6 U$1.D3
D4: U$1.D4
D5: LCD.11 U$1.D5
D6: LCD.12 U$1.D6
D7: LCD.13 U$1.D7
D8: LCD.14 U$1.D8
GNDIO: 4-20MA.2 5K.1 100E.1 C75.2 IC18.4(P:V-) R94.1 R96.1 VO.3
N$67: IC17.1(VCC) R84.1
N$68: HALL.2 IC17.3(OUT) R85.1
N$78: HALL.1 R84.2 R85.2
N$79: HALL.3 IC17.2(GND)
N$81: IC18.1(A:OUT) R98.2 R99.1
N$102: IC18.2(A:-IN) R99.2 R101.1
N$104: U$1.RX
N$105: U$1.TX
N$106: U$1.RST
N$107: U$1.EN
N$108: U$1.CLK
N$109: U$1.CMD
N$110: U$1.SD3
N$111: U$1.RSV@1(RSV)
N$112: U$1.RSV@0(RSV)
N$113: LCD.3 R60.1
N$114: OK2.1(A) R63.1
N$115: D.C L3.1 Q.S
N$116: OK8.1(A) R72.1
N$117: IC14.12(A:O) OK2.2(C)
N$118: IC14.10(B:O) IC14.13(A:I)
N$119: IC14.8(C:O) OK8.2(C)
N$120: IC15.12(X3)
N$121: IC15.1(X4)
N$122: IC15.5(X5)
N$123: IC15.2(X6)
N$124: IC15.4(X7)
N$125: BRIDGE.1 C73.1 IC16.4(V-) IC16.5(REF) LOAD.3
N$126: IC16.6(OUT) LOAD.2
N$127: BRIDGE.2 C73.2 IC16.7(V+) LOAD.1
N$128: IC16.1(RG) R93.1
N$129: IC16.8(RG) R93.2
N$130: BRIDGE.4 IC16.2(-IN)
N$131: BRIDGE.3 IC16.3(+IN)
N$132: IC18.7(B:OUT) R94.2 R95.1 VO.2
N$133: IC18.6(B:-IN) R95.2 R98.1
N$134: IC18.5(B:+IN) R96.2 R97.1
N$135: 5K.2 5K.3 IC18.3(A:+IN) R100.1
N$136: 4-20MA.1 R101.2 R102.2
N$137: 100E.2 100E.3 R102.1
NAGND: BAT.2 C.- L3.2 OK2.3(EMIT) OK8.3(EMIT) PVC.2 R.1 TRX.3 ; supply symbol labelled AGND
NGND: C70.2 IC14.7(P:GND) IC15.6(INH) IC15.7(VEE) IC15.8(GND) INT.3 LCD.1 LCD.5 LCD.16 R60.2 U$1.GND@0(GND) U$1.GND@1(GND) U$1.GND@2(GND) U$1.GND@3(GND) X.3 Y.3 Z.3 ; supply symbol labelled GND
SD0: IC15.11(A) U$1.SD0
SD1: IC15.10(B) U$1.SD1
SD2: IC15.9(C) U$1.SD2
V+: C75.1 IC18.8(P:V+) R97.2 R100.2 VO.1
X0: IC15.13(X0) X.2
X1: IC15.14(X1) Y.2
X2: IC15.15(X2) Z.2
Unconnected: IC14.1(D:I) IC14.2(D:O) IC14.3(E:I) IC14.4(E:O) IC14.5(F:I) IC14.6(F:O) LCD.7 LCD.8 LCD.9 LCD.10

### Notes on the sheet
- Need to take care about drill holes of PCB while routing
- Buck-Boost Converter

## Library data of the parts
0E1 R1 R3-R16 R18-R31 R40-R45 R47-R58 R61 R62 R67-R71 R74-R83 = resistor:R-US_: RESISTOR, American symbol
0E2 C1-C5 C7-C12 C15 C18-C25 C27-C30 C32-C56 C58 C70 C73 C75 = resistor:C-EU: CAPACITOR, European symbol
4-20MA BUZ RL = pinhead:PINHD-1X2: PIN HEADER
5K 100E COM-O FREQ HALL LOAD TRX VO ZCD = pinhead:PINHD-1X3: PIN HEADER
15-0-15 FREQ_CON INT ON/OFF PWC TMP-SET X Y Z = con-phoenix-508:MKDSN1,5/3-5,08: MKDSN 1,5/ 3-5,08 Printklemme Nennstrom: 13,5 A Nennspannung: 250 V Rastermaß: 5,08 mm Polzahl: 3 Anschlussart: Schraubanschluss Montage: Löten Anschlussrichtung Leiter/Platine: 0 ° Artikelnummer: 1729131 Source: http://eshop.phoenixcontact.com .. 1729131.pdf; MPN: SMKDSN1,5/3-5,08; OC_FARNELL: 1792904; OC_NEWARK: 70R0299
15AC AC-9V AGAIN BAT DC-12V HF-CT INCH MC-RST OC_RST PVC THC-K = con-phoenix-508:MKDSN1,5/2-5,08: MKDSN 1,5/ 2-5,08 Printklemme Nennstrom: 13,5 A Nennspannung: 250 V Rastermaß: 5,08 mm Polzahl: 2 Anschlussart: Schraubanschluss Montage: Löten Anschlussrichtung Leiter/Platine: 0 ° Artikelnummer: 1729128 Source: http://eshop.phoenixcontact.com .. 1729128.pdf; MPN: MKDSN 1,5/2-5.08; OC_FARNELL: 1792903; OC_NEWARK: 30M2397
16M = crystal:CRYTAL: CRYSTAL
78_15 = v-reg:78XX-TO3: VOLTAGE REGULATOR
7805 7812 7815 = v-reg:78XXS: VOLTAGE REGULATOR
7915 = v-reg:79XXS: VOLTAGE REGULATOR
AD8495 = ad849x:AD849X
AUT CT DC-I DC-V G_ND GND GNDA H1F H2F L1F L2F PD1 PD2 PDO PWMA PWMB PWMC TH-VO = pinhead:PINHD-1X1: PIN HEADER
B1 = rectifier:RB1A: RECTIFIER 1 A
BRIDGE LEM = pinhead:PINHD-1X4: PIN HEADER
C C13 C14 C16 C17 C26 C31 C57 C59 C72 = resistor:CPOL-EU: POLARIZED CAPACITOR, European symbol
C6 = resistor:CPOL-US: POLARIZED CAPACITOR, American symbol
C60 = DISCRETE:ELC-2,5
C61-C69 C71 C74 C76 C77 = resistor:C-US: CAPACITOR, American symbol
D D5-D8 D13 = diode:1N4004: DIODE general purpose rectifier, 1 A
D1-D4 = diode:1N5908: DIODE schottky
D9 D10 = diode:ZENER-DIODE: Z-Diode
D11 D15 = diode:MBRA340T3: Surface Mount Schottky Power Rectifier Source: http://www.onsemi.com/pub_link/Collateral/MBRA340T3-D.PDF
D12 D14 D17-D20 = SparkFun-DiscreteSemi:BAV99: Two small signal silicon diodes connected anode to cathode. Connections to all three nodes available. DIO-10647; PROD_ID: DIO-10647
D16 = diode:BZV10: Z DIODE
DS1307 = dallas-1:DS1307: I2C Serial RTC w/56 bytes battery backed RAM
FB3 FB4 = diode:1N5061: DIODE controlled avalanche rectifier
GATE_DRIVER1 GATE_DRIVER2 = pinhead:PINHD-2X7: PIN HEADER
GLCD = SparkFun:LCD-G12864: Graphical LCD 128x64 Footprint is not yet proven. Double check it. Spark Fun Electronics SKU : LCD-00710
IC1 = linear:TL084: OP AMP
IC2 = 40xx:4001: Quad 2-input NOR
IC3 IC9 = linear:TL082: OP AMP
IC4 IC7 = 40xx:4093: Quad 2-input NAND schmitt trigger
IC5 IC6 IC13 = linear:LM311: COMPARATOR
IC8 = linear:TL072: OP AMP
IC10 IC14 = 74xx-eu:74*14: Hex schmitt trigger INVERTER
IC11 = 74xx-eu:74*74: Dual D type positive edge triggered FLIP FLOP, preset and clear
IC12 = 74xx-eu:74*08: Quad 2-input AND gate
IC15 = 40xx:4051: 8-channel ANALOG MULTIPLEXER
IC16 = burr-brown:INA114: Precision Instrumentation Amplifier; MF: TEXAS INSTRUMENTS; MPN: INA114BP; OC_FARNELL: 1212399; OC_NEWARK: 74K3810
IC17 = allegro:A13*?: Linear Hall Effect Sensor ICs Continuous-Time Ratiometric High-Temperature Operation Programmable Linear with Analog Output A1302 -Replacement- UGN3503 Source: http://www.allegromicro.com/en/Products/Part_Numbers/1301/1301.pdf http://www.allegromicro.com/en/Products/Part_Numbers/1321/1321.pdf http://www.allegromicro.com/en/Products/Part_Numbers/1381/1381.pdf; MF: ALLEGRO MICROSYSTEMS, INC.; MPN: A1301EUA-T; OC_FARNELL: 1198085; OC_NEWARK: 31K6635
IC18 = linear:LM358: OP AMP also LM158; LM258; LM2904 Source: http://cache.national.com/ds/LM/LM158.pdf
IC-13 = 45xx:4504: TTL or CMOS to CMOS hex LEVEL SHIFTER
ISO-IP KBD = pinhead:PINHD-1X5: PIN HEADER
ISP1 = SparkFun-Connectors:AVR_SPI_PROG2: AVR 10-pin ICSP Header This is the standard AVR In Circuit Serial Programming header. Minimal, but includes pin one indicator. Works with standard Olimex programmers. Also look for the 6-pin reduced version. Spark Fun Electronics SKU: PRT-00778
L1 = resistor:L-US: INDUCTOR, American symbol
L3 = resistor:L-EU: INDUCTOR, European symbol
LCD = pinhead:PINHD-1X16: PIN HEADER
MEGA128 = AVR-1:MEGA128: MICROCONTROLLER 128 Kbytes FLASH 4 Kbytes SRAM 4 Kbytes EEPROM DUAL USART 8-channel 10 bit ADC
OC PLED = led:LED: LED OSRAM: - CHIPLED LG R971, LG N971, LY N971, LG Q971, LY Q971, LO R971, LY R971 LH N974, LH R974 LS Q976, LO Q976, LY Q976 LO Q996 - Hyper CHIPLED LW Q18S LB Q993, LB Q99A, LB R99A - SideLED LS A670, LO A670, LY A670, LG A670, LP A670 LB A673, LV A673, LT A673, LW A673 LH A674 LY A675 LS A676, LA A676, LO A676, LY A676, LW A676 LS A679, LY A679, LG A679 - Hyper Micro SIDELED® LS Y876, LA Y876, LO Y876, LY Y876 LT Y87S - SmartLED LW L88C, LW L88S LB L89C, LB L89S, LG L890 LS L89K, LO L89K, LY L89K LS L896, LA L896, LO L896, LY L896 - TOPLED LS T670, LO T670, LY T670, LG T670, LP T670 LSG T670, LSP T670, LSY T670, LOP T670, LYG T670 LG T671, LOG T671, LSG T671 LB T673, LV T673, LT T673, LW T673 LH T674 LS T676, LA T676, LO T676, LY T676, LB T676, LH T676, LSB T676, LW T676 LB T67C, LV T67C, LT T67C, LS T67K, LO T67K, LY T67K, LW E67C LS E67B, LA E67B, LO E67B, LY E67B, LB E67C, LV E67C, LT E67C LW T67C LS T679, LY T679, LG T679 LS T770, LO T770, LY T770, LG T770, LP T770 LB T773, LV T773, LT T773, LW T773 LH T774 LS E675, LA E675, LY E675, LS T675 LS T776, LA T776, LO T776, LY T776, LB T776 LHGB T686 LT T68C, LB T68C - Hyper Mini TOPLED® LB M676 - Mini TOPLED Santana® LG M470 LS M47K, LO M47K, LY M47K Source: http://www.osram.convergy.de LUXEON: - LUMILED® LXK2-PW12-R00, LXK2-PW12-S00, LXK2-PW14-U00, LXK2-PW14-V00 LXK2-PM12-R00, LXK2-PM12-S00, LXK2-PM14-U00 LXK2-PE12-Q00, LXK2-PE12-R00, LXK2-PE12-S00, LXK2-PE14-T00, LXK2-PE14-U00 LXK2-PB12-K00, LXK2-PB12-L00, LXK2-PB12-M00, LXK2-PB14-N00, LXK2-PB14-P00, LXK2-PB14-Q00 LXK2-PR12-L00, LXK2-PR12-M00, LXK2-PR14-Q00, LXK2-PR14-R00 LXK2-PD12-Q00, LXK2-PD12-R00, LXK2-PD12-S00 LXK2-PH12-R00, LXK2-PH12-S00 LXK2-PL12-P00, LXK2-PL12-Q00, LXK2-PL12-R00 Source: www.luxeon.com KINGBRIGHT: KA-3528ASYC Source: www.kingbright.com
OK1-OK8 = optocoupler:PC817: SHARP OPTO COUPLER; MPN: PC817X4J000F; OC_FARNELL: 9707727; OC_NEWARK: 97K7059
Q = transistor-power:IRF540: HEXFET Power MOSFET
Q1 Q3 Q5 = transistor-npn:BCW33*: NPN Transistor
Q6 = crystal:CRYSTAL: CRYSTAL
R R2 R32-R39 R59 R60 R63 R66 R72 R73 R84-R86 R88-R102 = resistor:R-EU_: RESISTOR, European symbol
R17 R65 = resistor-power:R: Power Resitor; OC_FARNELL: unknown; OC_NEWARK: unknown
R46 R64 R87 = resistor:R-TRIMM: Trimm resistor
RN1 = resistor-sil:G10R: SIL RESISTOR; OC_FARNELL: unknown; OC_NEWARK: unknown
U$1 = ESP12E_DEVKIT:ESP12E_DEVKIT: ESP12E DEVKIT BOARD
VDC = con-wago-508:W237-2N: WAGO SREW CLAMP; OC_FARNELL: unknown; OC_NEWARK: unknown